# Altium project PCB_Project2.PrjPCB
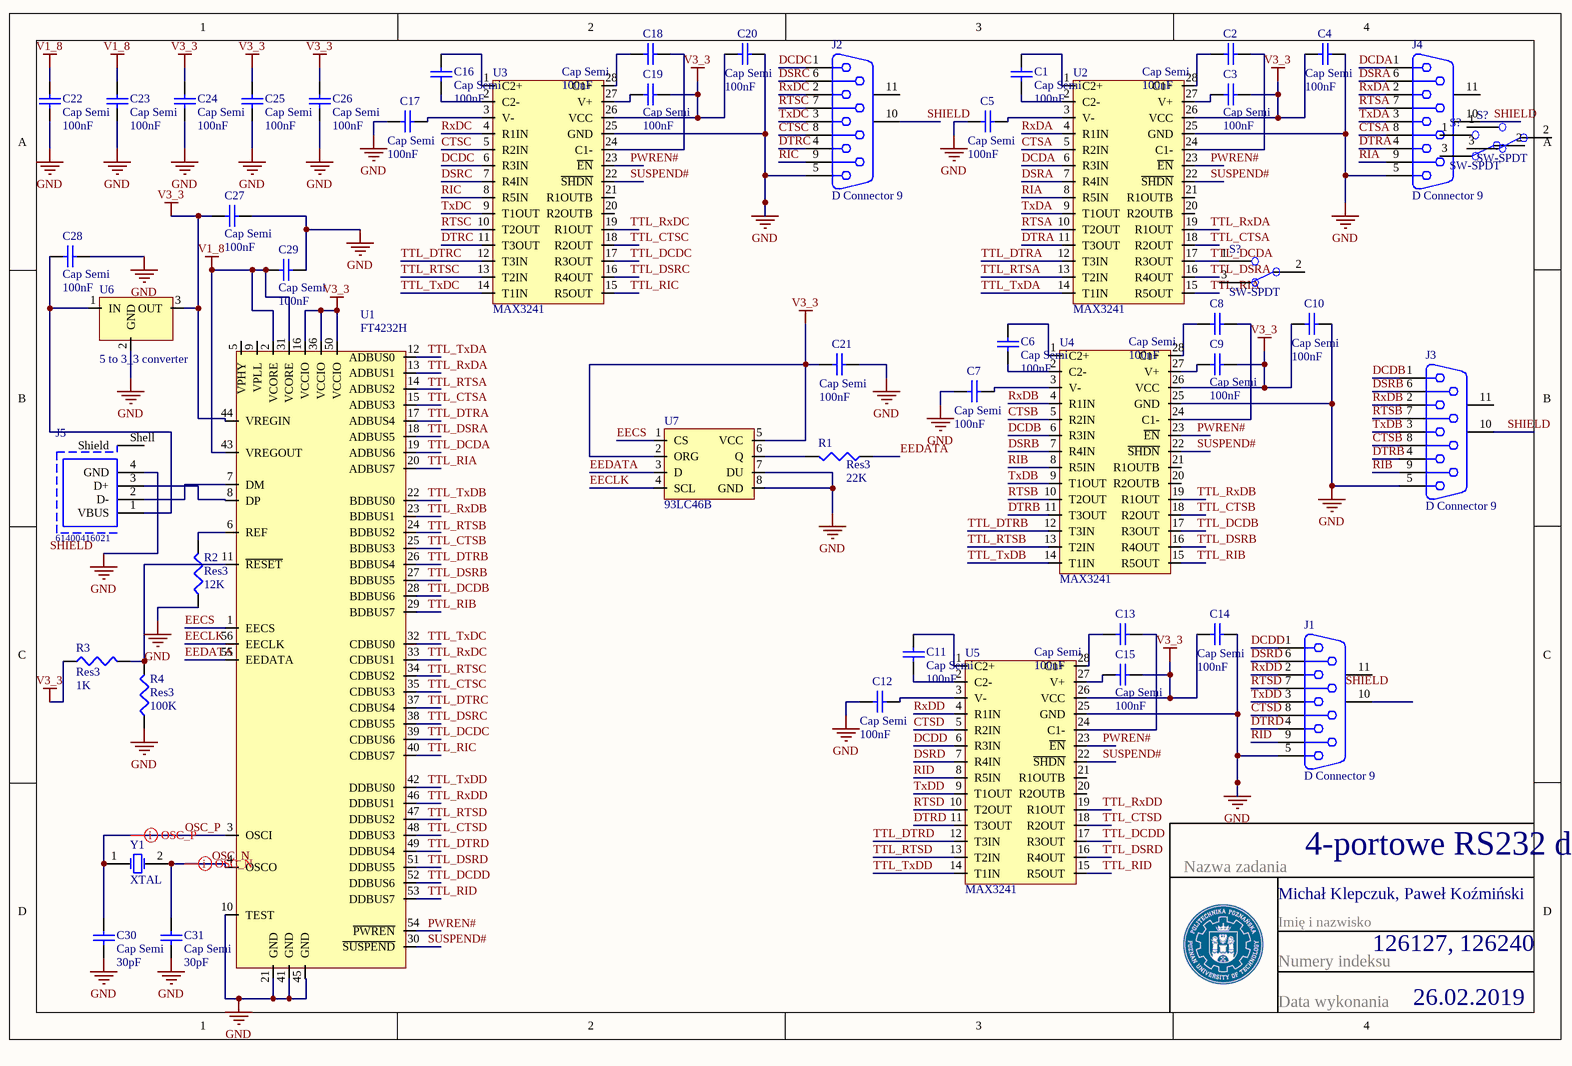
[diagram p0: RS232.SchDoc]
1 sheet, 51 parts. Net scope: global (net labels, ports and power ports of the same name join across sheets).
Board file: PCB2.PcbDoc

## Sheet RS232.SchDoc: 4-portowe RS232 do USB
size A4; Date: 26.02.2019; Author: Michał Klepczuk, Paweł Koźmiński; RegistrationBookNumber: 126127, 126240

### Parts
(Parts that share a designator on the sheet are numbered #1, #2 ... from top to bottom, then left to right.)
C1  Cap Semi  value 100nF  [CAPC3216L]
C2  Cap Semi  value 100nF  [CAPC3216L]
C3  Cap Semi  value 100nF  [CAPC3216L]
C4  Cap Semi  value 100nF  [CAPC3216L]
C5  Cap Semi  value 100nF  [CAPC3216L]
C6  Cap Semi  value 100nF  [CAPC3216L]
C7  Cap Semi  value 100nF  [CAPC3216L]
C8  Cap Semi  value 100nF  [CAPC3216L]
C9  Cap Semi  value 100nF  [CAPC3216L]
C10  Cap Semi  value 100nF  [CAPC3216L]
C11  Cap Semi  value 100nF  [CAPC3216L]
C12  Cap Semi  value 100nF  [CAPC3216L]
C13  Cap Semi  value 100nF  [CAPC3216L]
C14  Cap Semi  value 100nF  [CAPC3216L]
C15  Cap Semi  value 100nF  [CAPC3216L]
C16  Cap Semi  value 100nF  [CAPC3216L]
C17  Cap Semi  value 100nF  [CAPC3216L]
C18  Cap Semi  value 100nF  [CAPC3216L]
C19  Cap Semi  value 100nF  [CAPC3216L]
C20  Cap Semi  value 100nF  [CAPC3216L]
C21  Cap Semi  value 100nF  [CAPC3216L]
C22  Cap Semi  value 100nF  [CAPC3216L]
C23  Cap Semi  value 100nF  [CAPC3216L]
C24  Cap Semi  value 100nF  [CAPC3216L]
C25  Cap Semi  value 100nF  [CAPC3216L]
C26  Cap Semi  value 100nF  [CAPC3216L]
C27  Cap Semi  value 100nF  [CAPC3216L]
C28  Cap Semi  value 100nF  [CAPC3216L]
C29  Cap Semi  value 100nF  [CAPC3216L]
C30  Cap Semi  value 30pF  [CAPC3216L]
C31  Cap Semi  value 30pF  [CAPC3216L]
J1  D Connector 9  [DSUB1.385-2H9]
J2  D Connector 9  [DSUB1.385-2H9]
J3  D Connector 9  [DSUB1.385-2H9]
J4  D Connector 9  [DSUB1.385-2H9]
J5  61400416021  [61400416021]
R1  Res3  value 22K  [RESC1608L]
R2  Res3  value 12K  [RESC1608L]
R3  Res3  value 1K  [RESC1608L]
R4  Res3  value 100K  [RESC1608L]
S?#1  SW-SPDT  [SW-SPDT]
S?#2  SW-SPDT  [SW-SPDT]
S?#3  SW-SPDT  [SW-SPDT]
U1  FT4232H  [QFN50P800X800X100-56N]
U2  MAX3241  [SOP65P780X199-28N]
U3  MAX3241  [SOP65P780X199-28N]
U4  MAX3241  [SOP65P780X199-28N]
U5  MAX3241  [SOP65P780X199-28N]
U6  5 to 3_3 converter  [SOT230P700X180-4N]
U7  93LC46B  [TSOP65P640X120-8N]
Y1  XTAL  [BCY-W2/D3.1]

### Nets
GND: C4.2 C5.1 C7.1 C10.2 C12.1 C14.2 C17.1 C20.2 C21.2 C22.1 C23.1 C24.1 C25.1 C26.1 C27.2 C28.2 C29.2 C30.1 C31.1 J1.5 J2.5 J3.5 J4.5 J5.4(GND) R2.1 R4.1 U1.10(TEST) U1.21(GND) U1.41(GND) U1.45(GND) U2.25(GND) U3.25(GND) U4.25(GND) U5.25(GND) U6.2(GND) U7.7(DU) U7.8(GND)
V1_8: C22.2 C23.2 C29.1 U1.2(VCORE) U1.31(VCORE) U1.43(VREGOUT)
V3_3: C3.2 C4.1 C9.2 C10.1 C14.1 C15.2 C19.2 C20.1 C21.1 C24.2 C25.2 C26.2 C27.1 R3.1 U1.16(VCCIO) U1.36(VCCIO) U1.44(VREGIN) U1.50(VCCIO) U2.26(VCC) U3.26(VCC) U4.26(VCC) U5.26(VCC) U6.3(OUT) U7.2(ORG) U7.5(VCC)
CTSA: J4.8 U2.5(R2IN)
CTSB: J3.8 U4.5(R2IN)
CTSC: J2.8 U3.5(R2IN)
CTSD: J1.8 U5.5(R2IN)
DCDA: J4.1 U2.6(R3IN)
DCDB: J3.1 U4.6(R3IN)
DCDC: J2.1 U3.6(R3IN)
DCDD: J1.1 U5.6(R3IN)
DSRA: J4.6 U2.7(R4IN)
DSRB: J3.6 U4.7(R4IN)
DSRC: J2.6 U3.7(R4IN)
DSRD: J1.6 U5.7(R4IN)
DTRA: J4.4 U2.11(T3OUT)
DTRB: J3.4 U4.11(T3OUT)
DTRC: J2.4 U3.11(T3OUT)
DTRD: J1.4 U5.11(T3OUT)
EECLK: U1.56(EECLK) U7.4(SCL)
EECS: U1.1(EECS) U7.1(CS)
EEDATA: R1.1 U1.55(EEDATA) U7.3(D)
OSC_N: C31.2 U1.4(OSCO) Y1.2(OSC2)
OSC_P: C30.2 U1.3(OSCI) Y1.1(OSC1)
PWREN#: U1.54(~{PWREN}) U2.23(~{EN}) U3.23(~{EN}) U4.23(~{EN}) U5.23(~{EN})
RIA: J4.9 U2.8(R5IN)
RIB: J3.9 U4.8(R5IN)
RIC: J2.9 U3.8(R5IN)
RID: J1.9 U5.8(R5IN)
RTSA: J4.7 U2.10(T2OUT)
RTSB: J3.7 U4.10(T2OUT)
RTSC: J2.7 U3.10(T2OUT)
RTSD: J1.7 U5.10(T2OUT)
RxDA: J4.2 U2.4(R1IN)
RxDB: J3.2 U4.4(R1IN)
RxDC: J2.2 U3.4(R1IN)
RxDD: J1.2 U5.4(R1IN)
SHIELD: J2.10(MH1) J3.10(MH1) J4.10(MH1)
SUSPEND#: U1.30(~{SUSPEND}) U2.22(~{SHDN}) U3.22(~{SHDN}) U4.22(~{SHDN}) U5.22(~{SHDN})
TTL_CTSA: U1.15(ADBUS3) U2.18(R2OUT)
TTL_CTSB: U1.25(BDBUS3) U4.18(R2OUT)
TTL_CTSC: U1.35(CDBUS3) U3.18(R2OUT)
TTL_CTSD: U1.48(DDBUS3) U5.18(R2OUT)
TTL_DCDA: S?#3.1 U1.19(ADBUS6) U2.17(R3OUT)
TTL_DCDB: U1.28(BDBUS6) U4.17(R3OUT)
TTL_DCDC: U1.39(CDBUS6) U3.17(R3OUT)
TTL_DCDD: U1.52(DDBUS6) U5.17(R3OUT)
TTL_DSRA: U1.18(ADBUS5) U2.16(R4OUT)
TTL_DSRB: U1.27(BDBUS5) U4.16(R4OUT)
TTL_DSRC: U1.38(CDBUS5) U3.16(R4OUT)
TTL_DSRD: U1.51(DDBUS5) U5.16(R4OUT)
TTL_DTRA: U1.17(ADBUS4) U2.12(T3IN)
TTL_DTRB: U1.26(BDBUS4) U4.12(T3IN)
TTL_DTRC: U1.37(CDBUS4) U3.12(T3IN)
TTL_DTRD: U1.49(DDBUS4) U5.12(T3IN)
TTL_RIA: U1.20(ADBUS7) U2.15(R5OUT)
TTL_RIB: U1.29(BDBUS7) U4.15(R5OUT)
TTL_RIC: U1.40(CDBUS7) U3.15(R5OUT)
TTL_RID: U1.53(DDBUS7) U5.15(R5OUT)
TTL_RTSA: U2.13(T2IN)
TTL_RTSB: U4.13(T2IN)
TTL_RTSC: U3.13(T2IN)
TTL_RTSD: U5.13(T2IN)
TTL_RxDA: U1.13(ADBUS1) U2.19(R1OUT)
TTL_RxDB: U1.23(BDBUS1) U4.19(R1OUT)
TTL_RxDC: U1.33(CDBUS1) U3.19(R1OUT)
TTL_RxDD: U1.46(DDBUS1) U5.19(R1OUT)
TTL_TxDA: U1.12(ADBUS0) U2.14(T1IN)
TTL_TxDB: U1.22(BDBUS0) U4.14(T1IN)
TTL_TxDC: U1.32(CDBUS0) U3.14(T1IN)
TTL_TxDD: U1.42(DDBUS0) U5.14(T1IN)
TxDA: J4.3 U2.9(T1OUT)
TxDB: J3.3 U4.9(T1OUT)
TxDC: J2.3 U3.9(T1OUT)
TxDD: J1.3 U5.9(T1OUT)
NetC1_1: C1.1 U2.2(C2-)
NetC1_2: C1.2 U2.1(C2+)
NetC2_1: C2.1 U2.24(C1-)
NetC2_2: C2.2 U2.28(C1+)
NetC3_1: C3.1 U2.27(V+)
NetC5_2: C5.2 U2.3(V-)
NetC6_1: C6.1 U4.2(C2-)
NetC6_2: C6.2 U4.1(C2+)
NetC7_2: C7.2 U4.3(V-)
NetC8_1: C8.1 U4.24(C1-)
NetC8_2: C8.2 U4.28(C1+)
NetC9_1: C9.1 U4.27(V+)
NetC11_1: C11.1 U5.2(C2-)
NetC11_2: C11.2 U5.1(C2+)
NetC12_2: C12.2 U5.3(V-)
NetC13_1: C13.1 U5.24(C1-)
NetC13_2: C13.2 U5.28(C1+)
NetC15_1: C15.1 U5.27(V+)
NetC16_1: C16.1 U3.2(C2-)
NetC16_2: C16.2 U3.1(C2+)
NetC17_2: C17.2 U3.3(V-)
NetC18_1: C18.1 U3.24(C1-)
NetC18_2: C18.2 U3.28(C1+)
NetC19_1: C19.1 U3.27(V+)
NetC28_1: C28.1 J5.1(VBUS) U6.1(IN)
NetJ5_2: J5.2(D-) U1.7(DM)
NetJ5_3: J5.3(D+) U1.8(DP)
NetR1_2: R1.2 U7.6(Q)
NetR2_2: R2.2 U1.6(REF)
NetR3_2: R3.2 R4.2 U1.11(~{RESET})

Not connected (* = marked no-connect by the designer): J1 10(MH1) 11(MH2); J2 11(MH2); J3 11(MH2); J4 11(MH2); J5 Shell(Shield); S?#1 1 2 3; S?#2 1 2 3; S?#3 2 3; U1 5(VPHY) 9(VPLL) 14(ADBUS2) 24(BDBUS2) 34(CDBUS2) 47(DDBUS2); U2 20(R2OUTB) 21(R1OUTB); U3 20(R2OUTB) 21(R1OUTB); U4 20(R2OUTB) 21(R1OUTB); U5 20(R2OUTB) 21(R1OUTB)

### Layout directives
differential pair: OSC_N, OSC_P

### Notes on the sheet
- Labels drawn without touching a wire or pin: SHIELD, TTL_RTSA, TTL_RTSB, TTL_RTSC, TTL_RTSD
- Nazwa zadania
- Imię i nazwisko
- Numery indeksu
- Data wykonania

### Library data of the parts
C1-C31 = Cap Semi: Capacitor (Semiconductor SIM Model); Published: 8-Jun-2000; LatestRevisionDate: 29-May-2009; LatestRevisionNote: IPC-7351 Footprint Added.; PackageReference: C1206; Publisher: Altium Limited; PackageDescription: Chip Capacitor
J1-J4 = D Connector 9: Receptacle Assembly, 9 Position, Right Angle; PackageDocument: O; Positions: 9; Published: 15-Jun-2001; LatestRevisionDate: 17-Jul-2002; LatestRevisionNote: Re-released for DXP Platform.; DatasheetDocument: 1-Sep-1999; PackageReference: 788750; Publisher: Altium Limited; Orientation: Right Angle; Gender: Receptacle
J5 = 61400416021: USB 2.0 Type A Receptacle WR-COM, Horizontal, THT; Rated Current: 1.5 A; Contact Resistance: 20 mOhm; Working Voltage: 30 VAC; ComponentLink1Description: Manufacturer; ComponentLink1URL: http://www.we-online.de; ComponentLink2Description: Datasheet; ComponentLink2URL: https://katalog.we-online.de/em/datasheet/61400416021.pdf; Part Number: 61400416021; Published Date: September 2018; Publisher: Wurth Elektronik; Orientation: Horizontal; Connector Type: USB 2.0 Type A; Operating Temperature: -40 to 105 degC; Mounting Technology: THT; Gender: Receptacle; Packaging: Tray
R1-R4 = Res3: Resistor; Published: 8-Jun-2000; LatestRevisionDate: 29-May-2009; LatestRevisionNote: IPC-7351 Footprint Added.; PackageReference: J1-0603; Publisher: Altium Limited; PackageDescription: Chip Resistor
S?#1-S?#3 U7 = Component_4
U1 = Component_1
U2-U5 = Component_2
U6 = Component_3
Y1 = XTAL: Crystal Oscillator; Published: 8-Jun-2000; LatestRevisionDate: 17-Jul-2002; LatestRevisionNote: Re-released for DXP Platform.; PackageReference: R38; Publisher: Altium Limited